# Altium schematic sheet NFC.SchDoc
size A4; SheetNumber: 11; SheetTotal: 13
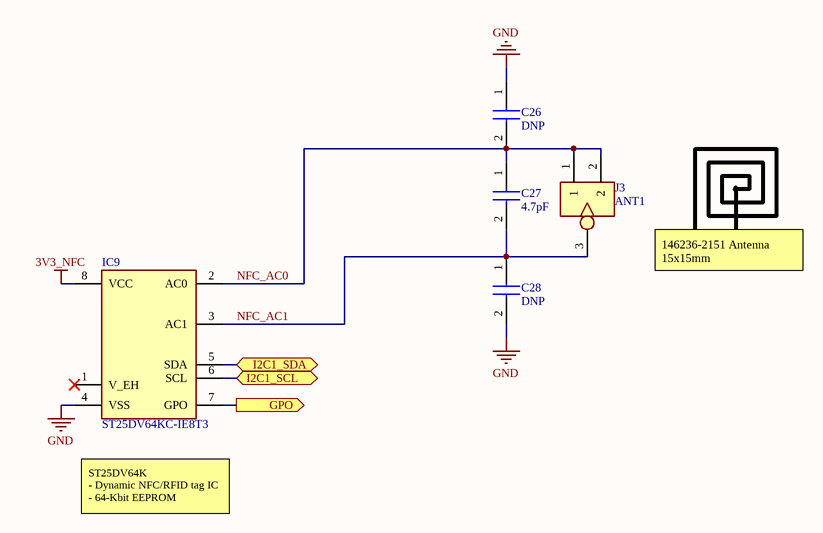
[diagram p0: NFC.SchDoc]

## Parts
C26  DNP  [CAPC1005X70N]
C27  4.7pF  [CAPC1005X70N]
C28  DNP  [CAPC1005X70N]
IC9  ST25DV64KC-IE8T3  [SOP65P640X120-8N]
J3  ANT1  [RECE.20279.001E.01]

## Ports
GPO (out, see main[3B], MCU[1C]), I2C1_SCL (bidir, see main[3B], Sensors[1B]), I2C1_SDA (bidir, see main[3B], Sensors[1B])

## Nets
3V3_NFC: IC9.8(VCC)
GND: C26.1 C28.2 IC9.4(VSS)
GPO: IC9.7(GPO) ; port GPO
I2C1_SCL: IC9.6(SCL) ; port I2C1_SCL
I2C1_SDA: IC9.5(SDA) ; port I2C1_SDA
NFC_AC0: C26.2 C27.1 IC9.2(AC0) J3.1 J3.2
NFC_AC1: C27.2 C28.1 IC9.3(AC1) J3.3

Not connected (* = marked no-connect by the designer): IC9 1(V_EH)*

## Notes on the sheet
- 146236-2151 Antenna 15x15mm
- ST25DV64K
  - Dynamic NFC/RFID tag IC
  - 64-Kbit EEPROM
- Title:
- Date:
- Project:
- Type:
- Schematic
- Variant:
- Revision:
- Sheet
- of
- Author:
- Evžen Šteif
- Size:
- A4

## Library data of the parts
C26-C28 = GRM1555C2A4R7WA01D: Capacitor; Manufacturer_Name: Murata Electronics; Datasheet Link: https://search.murata.co.jp/Ceramy/image/img/A01X/G101/ENG/GRM1555C2A4R7WA01-01A.pdf; Height: 0.7mm; Manufacturer_Part_Number: GRM1555C2A4R7WA01D; Mouser Part Number: 81-GRM1555C2A4R7WA1D; Mouser Price/Stock: https://www.mouser.com/Search/Refine.aspx?Keyword=81-GRM1555C2A4R7WA1D
IC9 = ST25DV64KC-IE8T3: Integrated Circuit; Manufacturer_Name: STMicroelectronics; Datasheet Link: https://www.st.com/resource/en/datasheet/st25dv64kc.pdf; Height: 1.2mm; Manufacturer_Part_Number: ST25DV64KC-IE8T3; Mouser Part Number: 511-ST25DV64KC-IE8T3; Mouser Price/Stock: https://www.mouser.co.uk/ProductDetail/STMicroelectronics/ST25DV64KC-IE8T3?qs=QNEnbhJQKva4ZdUvGL0fuA%3D%3D; Arrow Part Number: ST25DV64KC-IE8T3; Arrow Price/Stock: https://www.arrow.com/en/products/st25dv64kc-ie8t3/stmicroelectronics?utm_currency=USD&region=nac
J3 = RECE-20279-001E-01: Connector; Manufacturer_Name: Taoglas; Manufacturer_Part_Number: RECE-20279-001E-01; Mouser Part Number: N/A; Mouser Price/Stock: https://www.mouser.co.uk/ProductDetail/Taoglas/RECE-20279-001E-01?qs=WUa1z%2FNV9%252B3mVij1vDlP0A%3D%3D